# EAGLE design Organ_fix1 (EAGLE 7.7.0)
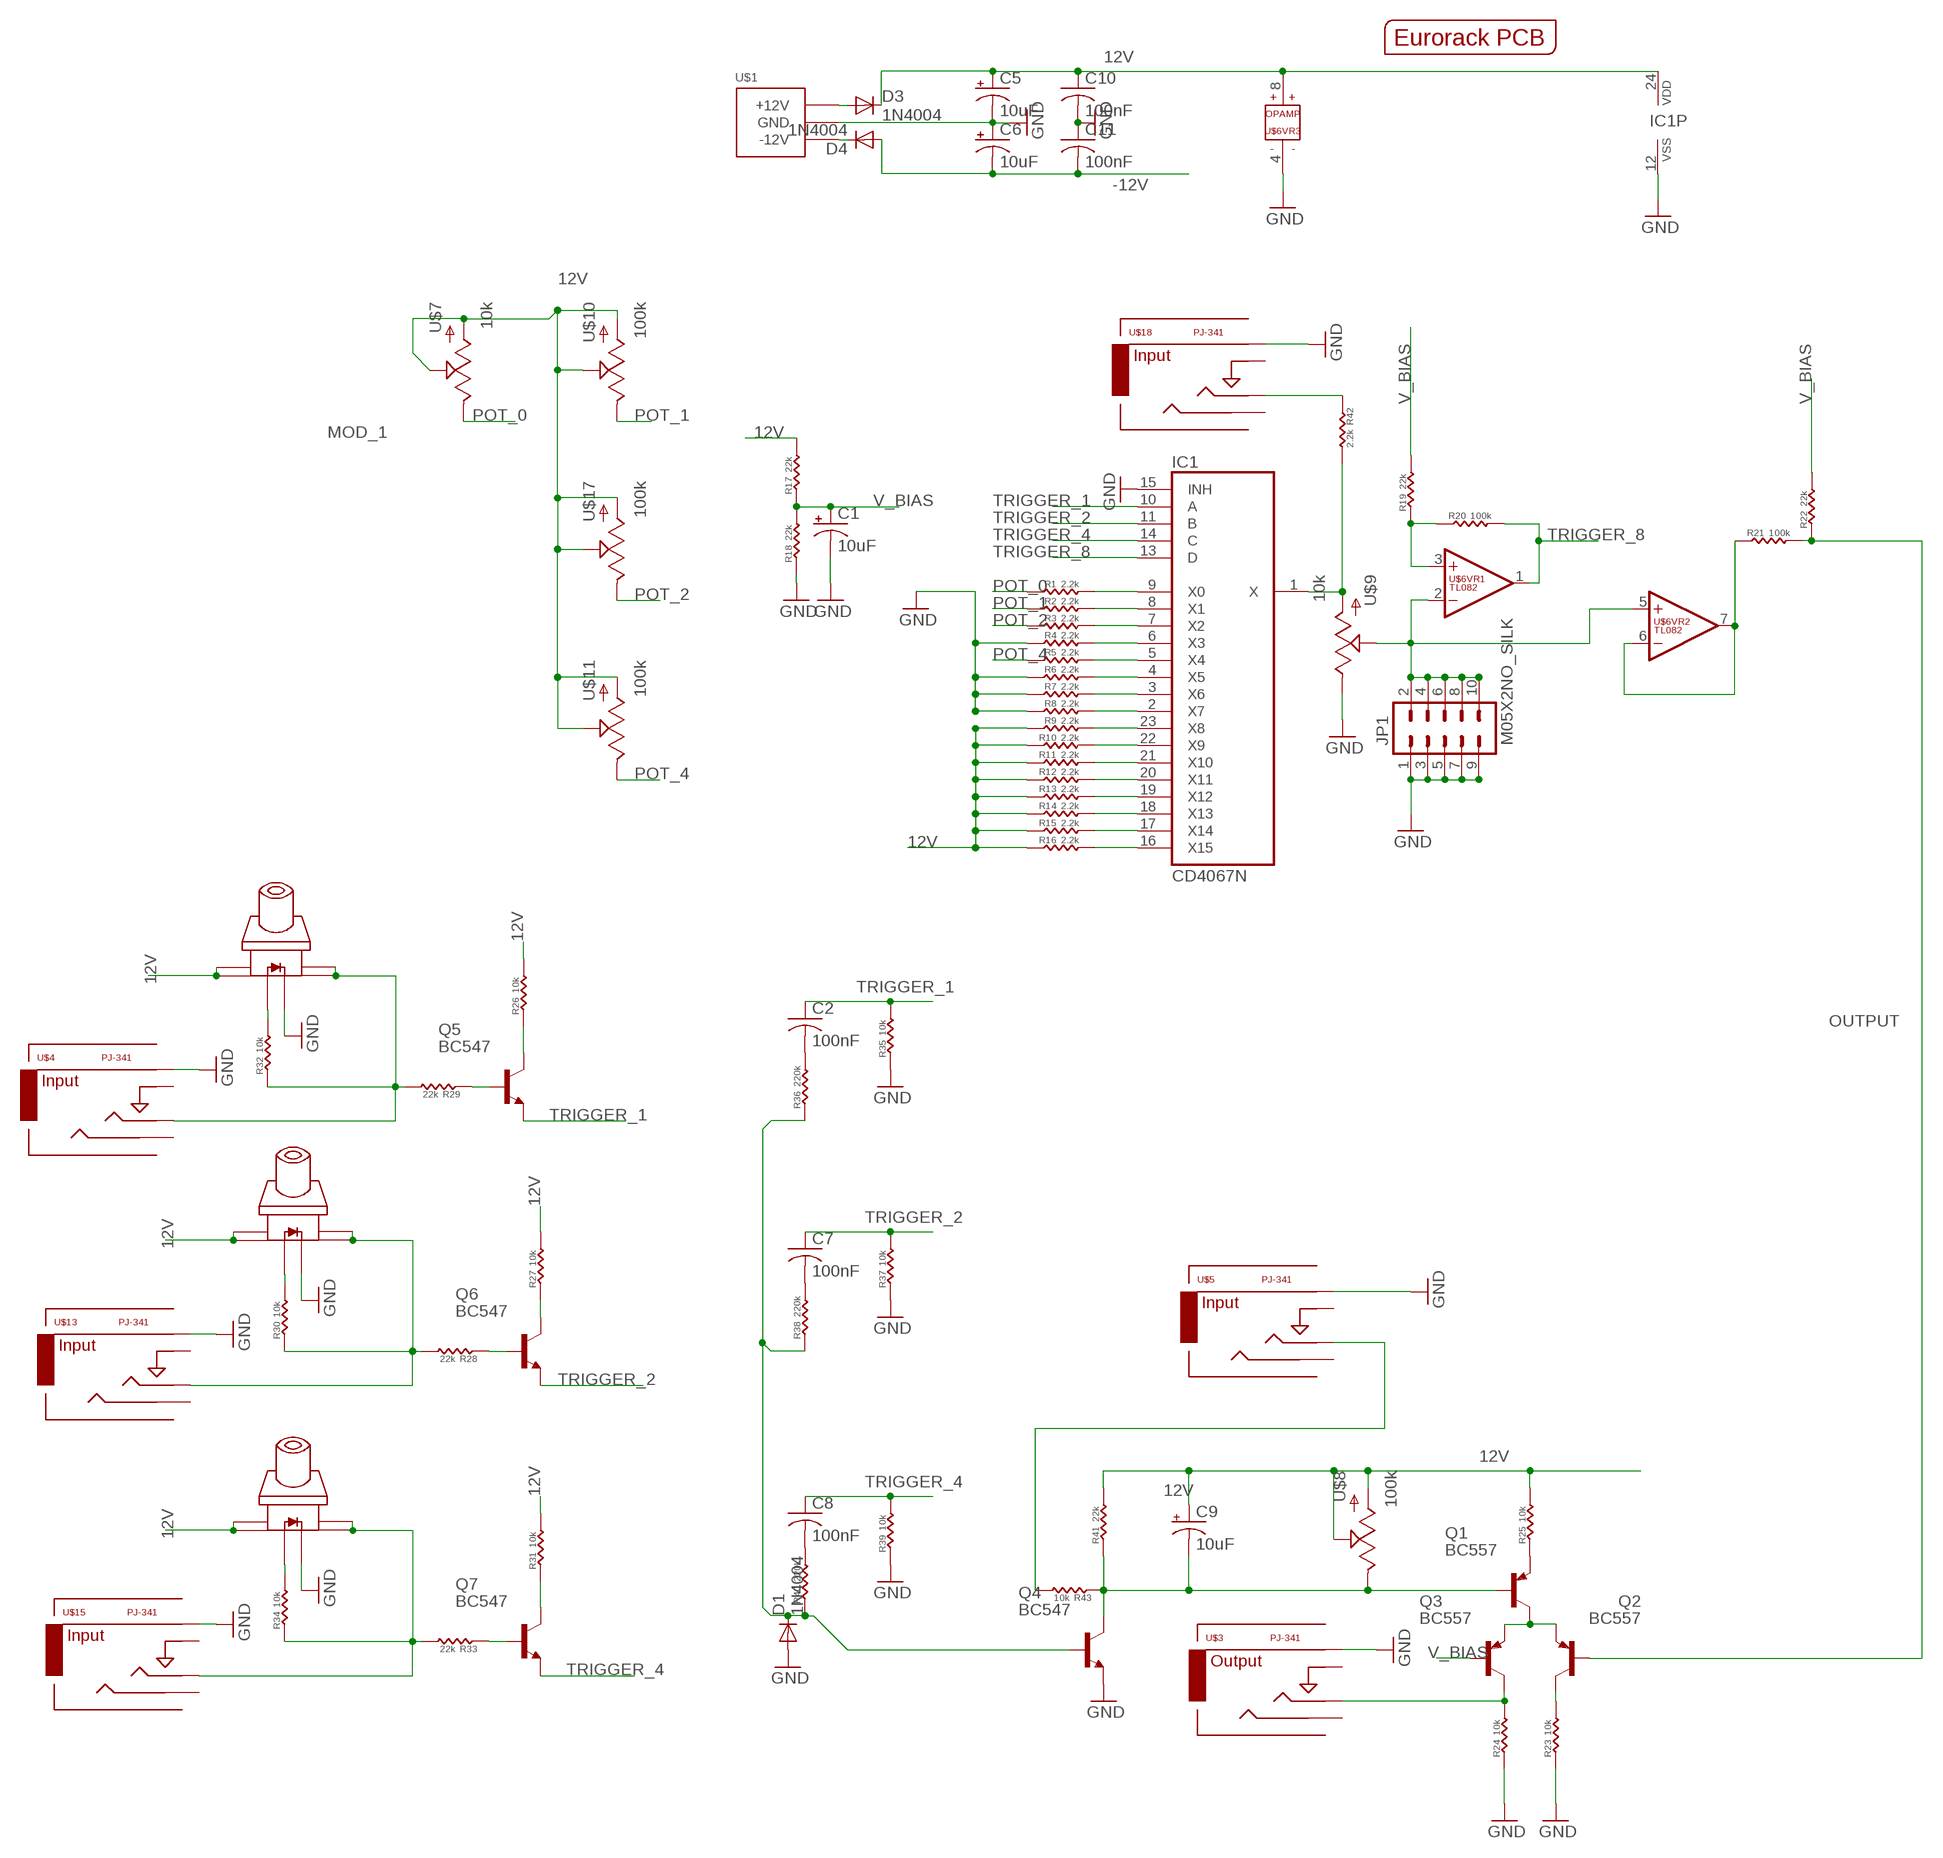
[diagram p0: schematic, sheet 1]

## Parts
C1  10uF  CPOL-USTT2D6  [TT2D6]
C2  100nF  C-US050-025X075  [C050-025X075]
C5  10uF  CPOL-USTT2D6  [TT2D6]
C6  10uF  CPOL-USTT2D6  [TT2D6]
C7  100nF  C-US050-025X075  [C050-025X075]
C8  100nF  C-US050-025X075  [C050-025X075]
C9  10uF  CPOL-USTT2D6  [TT2D6]
C10  100nF  C-US050-025X075  [C050-025X075]
C11  100nF  C-US050-025X075  [C050-025X075]
D1  1N4004  [DO41-10]
D3  1N4004  [DO41-10]
D4  1N4004  [DO41-10]
IC1  CD4067N  4067N  [DIL24-6]
JP1  M05X2NO_SILK  [2X5_NOSILK]
Q1  BC557  BC557TO92  [TO92]
Q2  BC557  BC557TO92  [TO92]
Q3  BC557  BC557TO92  [TO92]
Q4  BC547  [TO92]
Q5  BC547  [TO92]
Q6  BC547  [TO92]
Q7  BC547  [TO92]
R1  2.2k  R-US_0204/5  [0204/5]
R2  2.2k  R-US_0204/5  [0204/5]
R3  2.2k  R-US_0204/5  [0204/5]
R4  2.2k  R-US_0204/5  [0204/5]
R5  2.2k  R-US_0204/5  [0204/5]
R6  2.2k  R-US_0204/5  [0204/5]
R7  2.2k  R-US_0204/5  [0204/5]
R8  2.2k  R-US_0204/5  [0204/5]
R9  2.2k  R-US_0204/5  [0204/5]
R10  2.2k  R-US_0204/5  [0204/5]
R11  2.2k  R-US_0204/5  [0204/5]
R12  2.2k  R-US_0204/5  [0204/5]
R13  2.2k  R-US_0204/5  [0204/5]
R14  2.2k  R-US_0204/5  [0204/5]
R15  2.2k  R-US_0204/5  [0204/5]
R16  2.2k  R-US_0204/5  [0204/5]
R17  22k  R-US_0204/5  [0204/5]
R18  22k  R-US_0204/5  [0204/5]
R19  22k  R-US_0204/5  [0204/5]
R20  100k  R-US_0204/5  [0204/5]
R21  100k  R-US_0204/5  [0204/5]
R22  22k  R-US_0204/5  [0204/5]
R23  10k  R-US_0204/5  [0204/5]
R24  10k  R-US_0204/5  [0204/5]
R25  10k  R-US_0204/5  [0204/5]
R26  10k  R-US_0204/5  [0204/5]
R27  10k  R-US_0204/5  [0204/5]
R28  22k  R-US_0204/5  [0204/5]
R29  22k  R-US_0204/5  [0204/5]
R30  10k  R-US_0204/5  [0204/5]
R31  10k  R-US_0204/5  [0204/5]
R32  10k  R-US_0204/5  [0204/5]
R33  22k  R-US_0204/5  [0204/5]
R34  10k  R-US_0204/5  [0204/5]
R35  10k  R-US_0204/5  [0204/5]
R36  220k  R-US_0204/5  [0204/5]
R37  10k  R-US_0204/5  [0204/5]
R38  220k  R-US_0204/5  [0204/5]
R39  10k  R-US_0204/5  [0204/5]
R40  220k  R-US_0204/5  [0204/5]
R41  22k  R-US_0204/5  [0204/5]
R42  2.2k  R-US_0204/5  [0204/5]
R43  10k  R-US_0204/5  [0204/5]
U$1  POWER_SIMPLE10  [POWER_10]
U$2  EURORACK_PCB12HP  [EURORACK12HPPCB]
U$3  PJ-341  AUDIO-JACKOUTPUT  [3.5MM-JACK-SWITCH-13MM-OUTPUT]
U$4  PJ-341  AUDIO-JACKINPUT  [3.5MM-JACK-SWITCH-13MM-INPUT]
U$5  PJ-341  AUDIO-JACKINPUT  [3.5MM-JACK-SWITCH-13MM-INPUT]
U$6  TL082  TL072DIP  [DIL08]
U$7  10k  POTZEPHPOT_SMALLHOLE  [POT_SMALLERHOLE]
U$8  100k  POTZEPHPOT_SMALLHOLE  [POT_SMALLERHOLE]
U$9  10k  POTZEPHPOT_SMALLHOLE  [POT_SMALLERHOLE]
U$10  100k  POTZEPHPOT_SMALLHOLE  [POT_SMALLERHOLE]
U$11  100k  POTZEPHPOT_SMALLHOLE  [POT_SMALLERHOLE]
U$12  SWITCH_W_LED_PB6149L-X-102YELLOW  [PB6149L]
U$13  PJ-341  AUDIO-JACKINPUT  [3.5MM-JACK-SWITCH-13MM-INPUT]
U$14  SWITCH_W_LED_PB6149L-X-102YELLOW  [PB6149L]
U$15  PJ-341  AUDIO-JACKINPUT  [3.5MM-JACK-SWITCH-13MM-INPUT]
U$16  SWITCH_W_LED_PB6149L-X-102YELLOW  [PB6149L]
U$17  100k  POTZEPHPOT_SMALLHOLE  [POT_SMALLERHOLE]
U$18  PJ-341  AUDIO-JACKINPUT  [3.5MM-JACK-SWITCH-13MM-INPUT]

## Nets
12V: C5.+ C9.+ C10.1 D3.C IC1.24(VDD) R9.1 R10.1 R11.1 R12.1 R13.1 R14.1 R15.1 R16.1 R17.2 R25.2 R26.2 R27.2 R31.2 R41.2 U$6.8(VR3:V+) U$7.P$2(S) U$7.P$3(A) U$8.P$2(S) U$8.P$3(A) U$10.P$2(S) U$10.P$3(A) U$11.P$2(S) U$11.P$3(A) U$12.1 U$12.2 U$14.1 U$14.2 U$16.1 U$16.2 U$17.P$2(S) U$17.P$3(A)
-12V: C6.- C11.2 D4.A
GND: C1.- C5.- C6.+ C10.2 C11.1 D1.A IC1.12(VSS) IC1.15(INH) JP1.1 JP1.3 JP1.5 JP1.7 JP1.9 Q4.1(E) R4.1 R6.1 R7.1 R8.1 R18.1 R23.1 R24.1 R35.1 R37.1 R39.1 U$1.3(GND) U$1.4(GND) U$1.5(GND) U$1.6(GND) U$1.7(GND) U$1.8(GND) U$3.RING@3(RING) U$4.RING@3(RING) U$5.RING@3(RING) U$6.4(VR3:V-) U$9.P$1(E) U$12.LEDNEG(NEG) U$13.RING@3(RING) U$14.LEDNEG(NEG) U$15.RING@3(RING) U$16.LEDNEG(NEG) U$18.RING@3(RING)
MOD_1: IC1.1(X) R42.2 U$9.P$3(A)
N$1: IC1.9(X0) R1.2
N$2: IC1.8(X1) R2.2
N$3: IC1.7(X2) R3.2
N$4: IC1.6(X3) R4.2
N$5: IC1.5(X4) R5.2
N$6: IC1.4(X5) R6.2
N$7: IC1.3(X6) R7.2
N$8: IC1.2(X7) R8.2
N$9: IC1.23(X8) R9.2
N$10: IC1.22(X9) R10.2
N$11: IC1.21(X10) R11.2
N$12: IC1.20(X11) R12.2
N$13: IC1.19(X12) R13.2
N$14: IC1.18(X13) R14.2
N$15: IC1.17(X14) R15.2
N$16: IC1.16(X15) R16.2
N$17: D3.A U$1.9(+12V) U$1.10(+12V)
N$18: D4.C U$1.1(-12V) U$1.2(-12V)
N$19: R21.1 U$6.6(VR2:-IN) U$6.7(VR2:OUT)
N$20: JP1.2 JP1.4 JP1.6 JP1.8 JP1.10 U$6.2(VR1:-IN) U$6.5(VR2:+IN) U$9.P$2(S)
N$21: Q1.3(C) Q2.1(E) Q3.1(E)
N$22: R19.1 R20.1 U$6.3(VR1:+IN)
N$23: R42.1 U$18.TIP@3(TIP)
N$24: Q2.3(C) R23.2
N$25: Q3.3(C) R24.2 U$3.TIP@3(TIP)
N$26: R43.2 U$5.TIP@3(TIP)
N$27: Q1.1(E) R25.1
N$28: Q6.3(C) R27.1
N$29: Q5.3(C) R26.1
N$30: Q7.3(C) R31.1
N$44: C2.2 R36.2
N$45: C9.- Q1.2(B) Q4.3(C) R41.1 R43.1 U$8.P$1(E)
N$46: Q6.2(B) R28.1
N$47: Q5.2(B) R29.1
N$49: R30.2 U$14.LEDPOS(POS)
N$51: R32.2 U$12.LEDPOS(POS)
N$52: D1.C Q4.2(B) R36.1 R38.1 R40.1
N$53: Q7.2(B) R33.1
N$55: R34.2 U$16.LEDPOS(POS)
N$56: C7.2 R38.2
N$59: C8.2 R40.2
OUTPUT: Q2.2(B) R21.2 R22.1
POT_0: R1.1 U$7.P$1(E)
POT_1: R2.1 U$10.P$1(E)
POT_2: R3.1 U$17.P$1(E)
POT_4: R5.1 U$11.P$1(E)
TRIGGER_1: C2.1 IC1.10(A) Q5.1(E) R35.2
TRIGGER_1_IN: R29.2 R32.1 U$4.TIP@3(TIP) U$12.3 U$12.4
TRIGGER_2: C7.1 IC1.11(B) Q6.1(E) R37.2
TRIGGER_2_IN: R28.2 R30.1 U$13.TIP@3(TIP) U$14.3 U$14.4
TRIGGER_4: C8.1 IC1.14(C) Q7.1(E) R39.2
TRIGGER_4_IN: R33.2 R34.1 U$15.TIP@3(TIP) U$16.3 U$16.4
TRIGGER_8: IC1.13(D) R20.2 U$6.1(VR1:OUT)
V_BIAS: C1.+ Q3.2(B) R17.1 R18.2 R19.2 R22.2
Unconnected: U$3.SECOND@3(SECOND) U$3.SWITCH@3(SWITCH) U$4.SECOND@3(SECOND) U$4.SWITCH@3(SWITCH) U$5.SECOND@3(SECOND) U$5.SWITCH@3(SWITCH) U$13.SECOND@3(SECOND) U$13.SWITCH@3(SWITCH) U$15.SECOND@3(SECOND) U$15.SWITCH@3(SWITCH) U$18.SECOND@3(SECOND) U$18.SWITCH@3(SWITCH)

## Library data of the parts
C1 C5 C6 C9 = LompeOnderdelen:CPOL-US: POLARIZED CAPACITOR, American symbol
C2 C7 C8 C10 C11 = LompeOnderdelen:C-US: CAPACITOR, American symbol
D1 D3 D4 = adafruit:1N4004: DIODE General purpose 1N400x type rectifier (With bigger pads) http://www.ladyada.net/library/pcb/eaglelibrary.html
IC1 = LompeOnderdelen:4067: 16-channel ANALOG MULTIPLEXER
JP1 = SparkFun-Connectors:M05X2: Header 5x2 Standard 10-pin dual row 0.1" header. Commonly used with AVR-ISP. Use with Spark Fun Electronics SKU: PRT-00778
Q1-Q3 = LompeOnderdelen:BC557*: PNP Transistror
Q4-Q7 = LompeOnderdelen:BC547*: NPN Transistor
R1-R43 = LompeOnderdelen:R-US_: RESISTOR, American symbol
U$1 = EurorackModularParts:POWER_SIMPLE
U$2 = EurorackModularParts:EURORACK_PCB
U$3 = EurorackModularParts:AUDIO-JACK: Switching Mono 3.5mm Audio Jack from Erthenvar.; DESC: Output; MPN: PJ-341
U$4 U$5 U$13 U$15 U$18 = EurorackModularParts:AUDIO-JACK: Switching Mono 3.5mm Audio Jack from Erthenvar.; DESC: Input; MPN: PJ-341
U$6 = LompeOnderdelen:TL072
U$7-U$11 U$17 = EurorackModularParts:POT
U$12 U$14 U$16 = zephod-components:SWITCH_W_LED_PB6149L-X-102

## Net classes
0 default: width 0.406 mm, clearance 0.178 mm
3 groundplane: width 0.203 mm, clearance 0.203 mm

## Board
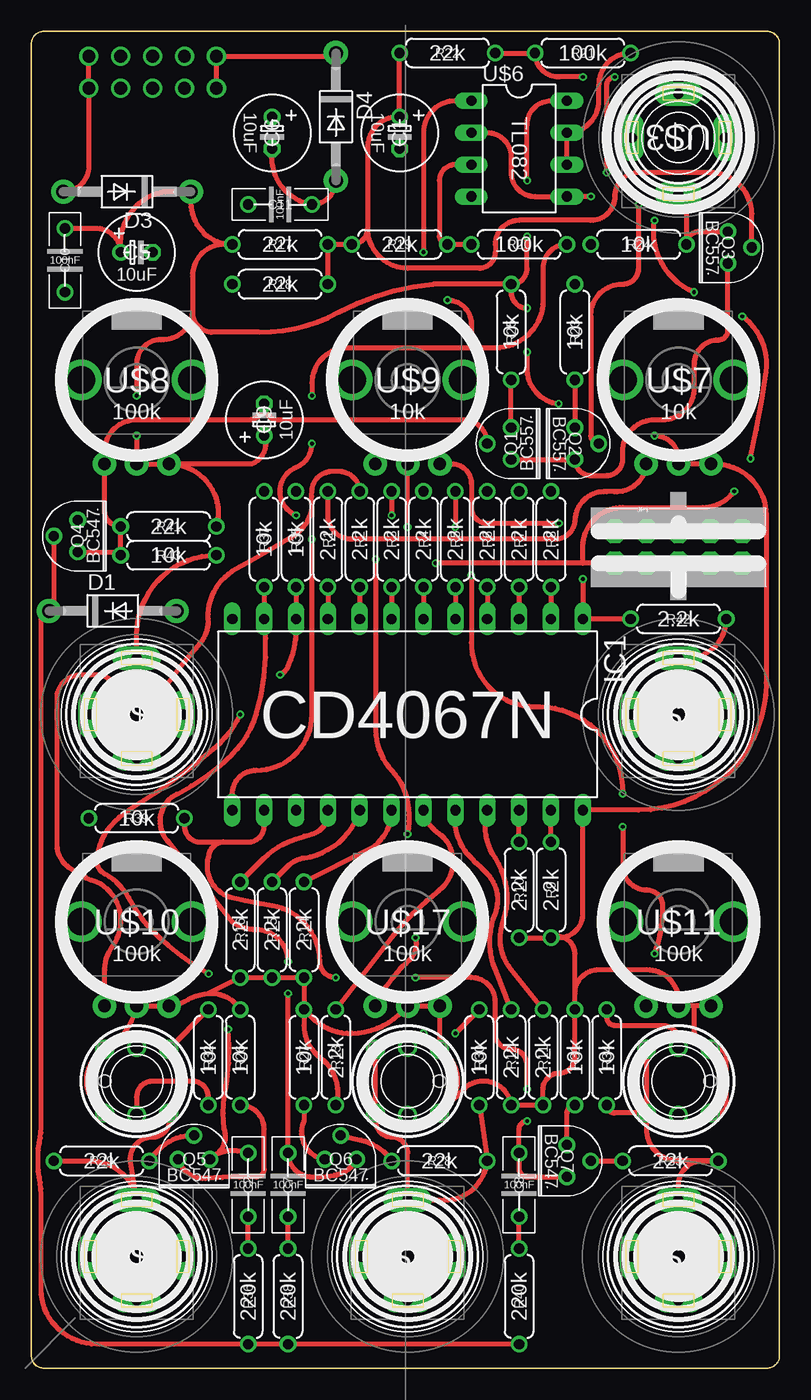
[diagram p1: board, top side]
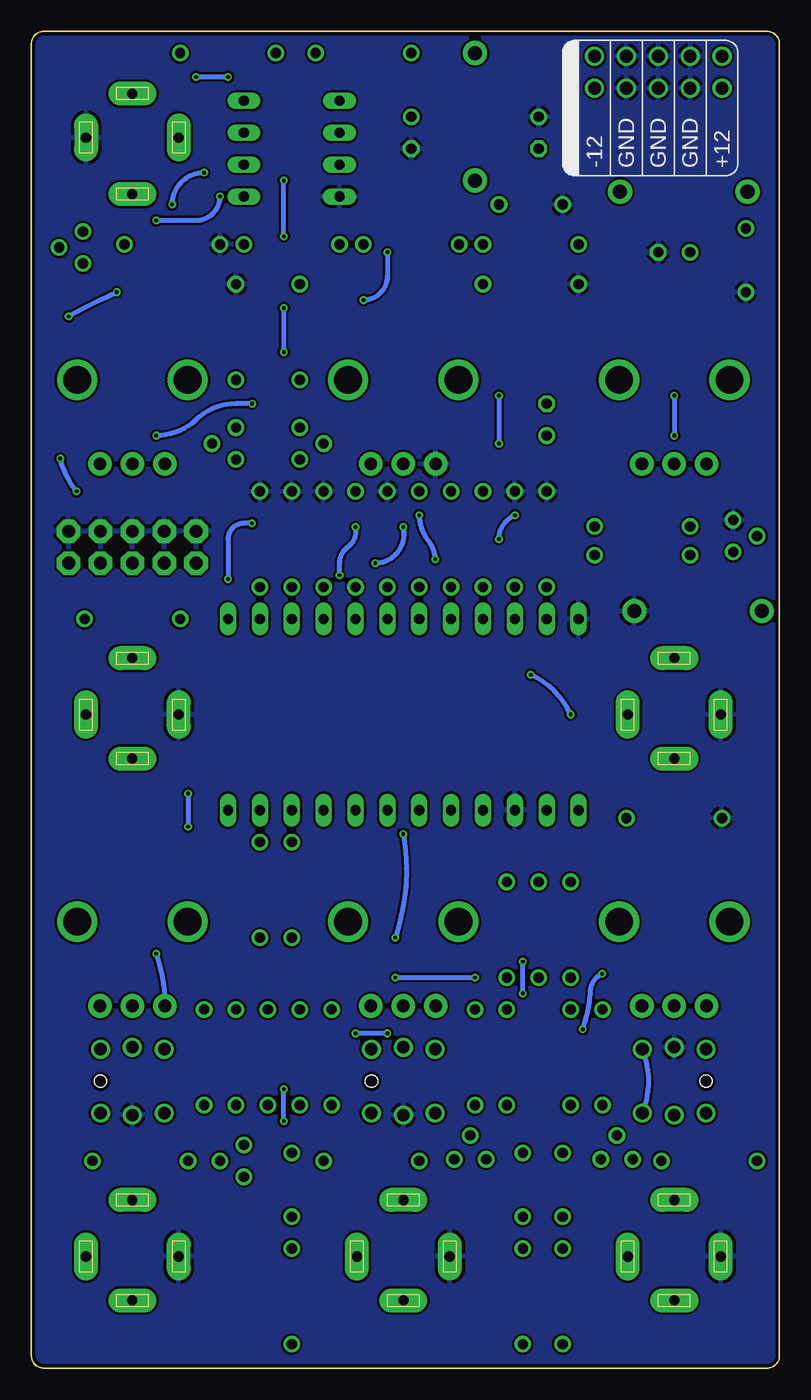
[diagram p2: board, bottom side, seen from below]

Size 59.62 x 106.5 mm. Coordinates in mm from the lower left corner, seen from the top.
Copper layers (1*16): Top 0.035mm / dielectric 1.5mm / Bottom 0.035mm
Design rules "ITEADstudio_DRC": minimum track width 6mil, minimum drill 12mil, track to track 6mil, track to pad 6mil, pad to pad 6mil, via to via 6mil, smd to smd 0mil, copper to edge 10mil, drill to drill 10mil, minimum pad ring 10mil, minimum via ring 6mil, stop-mask expansion 2mil, vias tented up to drill 100mil, thermal gap 10mil

### Footprints (pad centres in the part's own frame; a part is rotated, then mirrored left to right if it is on the bottom)
TT2D6 = drill 0.813: + -1.27,0 | drill 0.813 octagon: - 1.27,0
C050-025X075 = drill 0.813: 1 -2.54,0; 2 2.54,0
DO41-10 = drill 1.118 pad 1.93: A 5.08,0; C -5.08,0
DIL24-6 = drill 0.813 long: 1 -13.97,-7.62; 2 -11.43,-7.62; 3 -8.89,-7.62; 4 -6.35,-7.62; 5 -3.81,-7.62; 6 -1.27,-7.62; 7 1.27,-7.62; 8 3.81,-7.62; 9 6.35,-7.62; 10 8.89,-7.62; 11 11.43,-7.62; 12 13.97,-7.62; 13 13.97,7.62; 14 11.43,7.62; 15 8.89,7.62; 16 6.35,7.62; 17 3.81,7.62; 18 1.27,7.62; 19 -1.27,7.62; 20 -3.81,7.62; 21 -6.35,7.62; 22 -8.89,7.62; 23 -11.43,7.62; 24 -13.97,7.62
2X5_NOSILK = drill 1.016 pad 1.88 octagon: 1 -1.27,5.08; 2 1.27,5.08; 3 -1.27,2.54; 4 1.27,2.54; 5 -1.27,0; 6 1.27,0; 7 -1.27,-2.54; 8 1.27,-2.54; 9 -1.27,-5.08; 10 1.27,-5.08
TO92 = drill 0.813: 1 1.27,0; 2 0,1.905; 3 -1.27,0
0204/5 = drill 0.813: 1 -3.81,0; 2 3.81,0
POWER_10 = drill 1.016: 1 -5.08,-1.27; 2 -5.08,1.27; 3 -2.54,-1.27; 4 -2.54,1.27; 5 0,-1.27; 6 0,1.27; 7 2.54,-1.27; 8 2.54,1.27; 9 5.08,-1.27; 10 5.08,1.27
3.5MM-JACK-SWITCH-13MM-OUTPUT = drill 0.8 pad 1.93 long: RING@3 -3.7,0; SECOND@3 0,-3.5; SWITCH@3 3.7,0; TIP@3 0,4.5
3.5MM-JACK-SWITCH-13MM-INPUT = drill 0.8 pad 1.93 long: RING@3 -3.7,0; SECOND@3 0,-3.5; SWITCH@3 3.7,0; TIP@3 0,4.5
DIL08 = drill 0.813 long: 1 -3.81,-3.81; 2 -1.27,-3.81; 3 1.27,-3.81; 4 3.81,-3.81; 5 3.81,3.81; 6 1.27,3.81; 7 -1.27,3.81; 8 -3.81,3.81
POT_SMALLERHOLE = drill 1 pad 1.88: P$1 -2.58,-6.7; P$2 0,-6.7; P$3 2.58,-6.7 | drill 2.2 pad 3.175: P$4 4.4,0; P$5 -4.4,0
PB6149L = drill 1: 1 2.54,2.54; 2 2.54,-2.54; 3 -2.54,2.54; 4 -2.54,-2.54; LEDNEG 0,-2.7; LEDPOS 0,2.7 | hole 1: 2.54,0

### Placement (x,y rotation side)
C1  29.34,98.42 270 top
C2  17.28,14.61 270 top
C5  8.39,88.9 0 top
C6  19.18,98.42 270 top
C7  20.45,14.61 270 top
C8  38.87,14.61 270 top
C9  18.55,75.56 90 top
C10  2.67,88.27 270 top
C11  19.82,92.71 0 top
D1  6.49,60.33 0 top
D3  7.63,93.73 180 top
D4  24.27,99.69 270 top
IC1  29.98,52.07 180 top
JP1  51.57,65.41 270 top
Q1  38.23,73.66 90 top
Q2  43.31,73.66 270 top
Q3  55.51,89.28 270 top
Q4  3.69,66.29 90 top
Q5  12.96,16.64 0 top
Q6  24.65,16.64 0 top
Q7  42.68,16.51 270 top
R1  23.63,66.04 270 top
R2  26.17,66.04 270 top
R3  28.71,66.04 270 top
R4  31.25,66.04 270 top
R5  33.79,66.04 270 top
R6  36.33,66.04 270 top
R7  38.87,66.04 270 top
R8  41.41,66.04 270 top
R9  41.41,38.1 90 top
R10  38.87,38.1 90 top
R11  40.77,24.77 90 top
R12  38.23,24.77 90 top
R13  24.27,24.77 90 top
R14  21.73,34.92 90 top
R15  19.18,34.92 90 top
R16  16.64,34.92 90 top
R17  19.82,89.53 180 top
R18  19.82,86.36 0 top
R19  29.34,89.53 180 top
R20  38.87,89.53 0 top
R21  43.95,104.78 180 top
R22  33.16,104.78 180 top
R23  43.31,82.55 270 top
R24  48.4,89.53 0 top
R25  38.23,82.55 90 top
R26  16.64,24.77 90 top
R27  21.73,24.77 90 top
R28  32.52,16.51 0 top
R29  5.6,16.51 180 top
R30  35.7,24.77 90 top
R31  43.31,24.77 90 top
R32  14.11,24.77 270 top
R33  50.94,16.51 0 top
R34  45.85,24.77 90 top
R35  21.09,66.04 270 top
R36  17.28,5.71 90 top
R37  18.55,66.04 270 top
R38  20.45,5.71 90 top
R39  8.39,43.81 0 top
R40  38.87,5.71 90 top
R41  10.93,67.06 0 top
R42  51.57,59.69 180 top
R43  10.93,64.77 0 top
U$1  9.66,103.25 0 bottom
U$2  -0.5,0 0 top
U$3  51.57,98.04 180 top
U$4  8.39,8.89 0 top
U$5  8.39,52.07 0 top
U$6  38.87,97.16 270 top
U$7  51.57,78.74 0 top
U$8  8.39,78.74 0 top
U$9  29.98,78.74 0 top
U$10  8.39,35.56 0 top
U$11  51.57,35.56 0 top
U$12  8.39,22.86 180 top
U$13  29.98,8.89 0 top
U$14  29.98,22.86 0 top
U$15  51.57,8.89 0 top
U$16  51.57,22.86 0 top
U$17  29.98,35.56 0 top
U$18  51.57,52.07 0 top

### Tracks (layer width: path | path; a pad name or v marks a point on that pad's centre or on a via)
12V  (via drill 0.3)
  Top 0.406: U$8.P$3 U$8.P$2 v8.39,74.3 | C10.1 5.09,90.81 arc-90 C5.+ arc-90 10.68,93.73 D3.C 12.71,92.84 arc90 R17.2 15.38,89.53 arc90 12.84,87 12.84,84.15 | 12.84,84.15 arc-90 10.32,81.94 arc90 8.39,80.01 v8.39,77.47 | U$8.P$3 arc-106 R41.2 | C9.+ arc-90 17.57,72.04 U$8.P$3 | 12.84,84.15 arc90 14.44,82.55 18.14,82.55 arc30 24.49,84.12 arc-23 32.01,86.36 R25.2 | U$12.1 5.21,20.95 arc-106 U$12.2 arc50 U$10.P$2 U$10.P$3 arc32 12.2,29.21 arc-27 14.11,29.84 | U$16.2 54.74,20.32 arc90 55.38,20.95 55.38,24.77 arc90 54.74,25.4 U$16.1 arc-90 52.84,26.67 52.84,28.86 | 14.11,29.84 arc-63 R26.2 | 14.11,29.84 R16.1 R15.1 R14.1 R27.2 | R27.2 21.73,27.3 arc53 23,24.77 arc-69 R13.1 | U$14.2 33.16,20.95 | 33.16,20.95 arc106 U$14.1 32.52,28.86 U$17.P$3 U$17.P$2 arc-50 25.54,26.67 arc-46 22.36,27.94 R27.2 | 33.16,20.95 34.42,22.23 arc-127 R12.1 R11.1 40.77,22.23 arc-90 42.05,23.5 arc90 43.31,24.77 R31.2 43.31,29.84 | 43.31,29.84 43.31,33.02 arc111 R9.1 | R10.1 R9.1 | R25.2 arc90 39.51,87.63 v39.51,90.17 | v39.51,94.61 39.51,99.06 arc-90 41.41,100.97 U$6.8 | U$11.P$3 52.84,28.86 | 52.84,28.86 U$11.P$2 arc97 49.03,31.75 45.22,31.75 arc90 43.31,29.84 | R9.1 42.05,34.29 arc90 43.95,36.2 IC1.24 48.4,44.45 arc90 58.55,54.61 58.55,67.94 arc90 54.46,72.04 U$7.P$3 U$7.P$2 arc100 v49.66,74.3 | R25.2 38.23,85.72 arc90 v39.51,84.45 | v39.51,80.95 39.51,79.96 arc90 v42.02,76.83
  Bottom 0.406: v8.39,77.47 v8.39,74.3 | v39.51,90.17 v39.51,94.61 | v39.51,84.45 v39.51,80.95 | v42.02,76.83 43.31,76.83 arc-44 46.49,75.56 arc44 v49.66,74.3
-12V
  Top 0.406: C6.- arc90 C11.2 arc90 D4.A
GND
  pour Bottom: 0.14,106.68 59.83,106.68 59.83,0 0.14,0
MOD_1  (via drill 0.3)
  Top 0.406: R42.2 IC1.1 v43.95,62.87 | U$9.P$3 33.51,72.04 arc-90 35.06,70.48 35.06,68.58 arc90 36.33,67.31 v42.05,67.31
  Bottom 0.406: v42.05,67.31 42.68,67.31 arc-90 43.95,66.04 v43.95,62.87
N$1
  Top 0.406: R1.2 IC1.9
N$2
  Top 0.406: R2.2 IC1.8
N$3
  Top 0.406: R3.2 IC1.7
N$4
  Top 0.406: R4.2 IC1.6
N$5
  Top 0.406: R5.2 IC1.5
N$6
  Top 0.406: R6.2 IC1.4
N$7
  Top 0.406: R7.2 IC1.3
N$8
  Top 0.406: R8.2 IC1.2
N$9
  Top 0.406: R9.2 IC1.23
N$10
  Top 0.406: R10.2 IC1.22
N$11
  Top 0.406: R11.2 38.23,31.75 arc-58 37.6,35.56 arc54 36.97,40.64 arc-49 IC1.21
N$12
  Top 0.406: R12.2 36.97,31.75 arc-44 36.97,36.2 arc66 36.33,39.37 arc1 35.06,40.64 arc-54 IC1.20
N$13
  Top 0.406: R13.2 28.71,34.29 arc-14 32.52,38.1 arc85 33.16,41.91 arc24 32.52,42.55 arc-46 IC1.19
N$14
  Top 0.406: R14.2 26.8,41.27 arc65 IC1.18
N$15
  Top 0.406: R15.2 20.45,40.01 arc-37 21.73,40.64 arc65 IC1.17
N$16
  Top 0.406: R16.2 18.55,40.64 arc-23 20.45,41.91 arc-8 22.36,42.55 arc84 IC1.16
N$17
  Top 0.406: D3.A arc90 4.58,95.76 U$1.9 U$1.10
N$18
  Top 0.406: U$1.1 U$1.2 24.01,104.52 arc90 D4.C
N$19
  Top 0.406: R21.1 arc90 45.22,102.23 45.22,100.97 arc-90 U$6.7 U$6.6
N$20  (via drill 0.3)
  Top 0.406: U$6.2 36.33,98.42 arc-90 38.23,96.52 38.23,95.25 arc90 40.14,93.34 U$6.5 v44.59,93.34 | 29.98,72.39 U$9.P$2 v29.98,67 | JP1.2 JP1.4 JP1.6 JP1.8 JP1.10 43.95,64.14 | 43.95,64.14 v32.22,64.14 | 43.95,64.14 43.95,65.41 arc-53 45.22,67.94 arc-37 47.12,68.58 53.48,68.58 arc53 v56.02,69.85 | v57.31,72.47 arc5 58.55,79.38 arc63 v56.65,83.8 | v52.81,85.72 arc-77 v49.66,91.44
  Bottom 0.406: v32.22,64.14 arc-103 v29.98,67 | v56.02,69.85 arc27 v57.31,72.47 | v56.65,83.8 arc5 v52.81,85.72 | v49.66,91.44 46.49,91.44 arc-90 v44.59,93.34
N$21
  Top 0.406: Q3.1 55.51,82.68 arc-90 54.74,81.92 arc90 52.84,80.01 52.84,78.11 arc-90 50.3,75.56 49.66,75.56 arc90 47.12,73.03 47.12,72.39 arc-90 45.85,71.12 44.59,71.12 arc-90 Q2.1 Q1.3
N$22
  Top 0.406: R20.1 R19.1 arc-90 32.52,90.17 32.52,94.61 arc-90 33.79,95.89 U$6.3
N$23
  Top 0.406: U$18.TIP@3 52.26,56.57 arc90 R42.1
N$24
  Top 0.406: R23.2 Q2.3
N$25
  Top 0.406: U$3.TIP@3 arc-90 52.2,92.91 R24.2 arc-90 53.22,90.55 Q3.3
N$26
  Top 0.406: U$5.TIP@3 8.39,58.42 arc-90 R43.2
N$27
  Top 0.406: Q1.1 R25.1
N$28
  Top 0.406: R27.1 21.73,19.68 arc106 Q6.3
N$29
  Top 0.406: R26.1 arc-90 18.55,19.05 18.55,15.88 arc-90 17.91,15.24 arc4 13.85,15.11 arc-78 Q5.3
N$30
  Top 0.406: Q7.3 42.68,20.32 arc-90 R31.1
N$44
  Top 0.406: R36.2 C2.2
N$45
  Top 0.406: Q4.3 6.87,65.02 arc-90 R43.1 R41.1 arc-90 5.81,68.37 U$8.P$1 5.81,72.98 arc-90 8.39,75.56 17.41,75.56 arc90 C9.- arc90 19.57,75.56 34.42,75.56 arc-90 Q1.2
N$46
  Top 0.406: Q6.2 26.3,18.16 arc-43 R28.1
N$47
  Top 0.406: R29.1 9.91,17.14 arc-53 Q5.2
N$49  (via drill 0.3)
  Top 0.406: U$14.LEDPOS v31.25,26.67 | v33.79,26.67 R30.2
  Bottom 0.406: v31.25,26.67 v33.79,26.67
N$51
  Top 0.406: R32.2 14.11,21.59 arc90 12.84,22.86 9.66,22.86 arc90 8.39,21.59 U$12.LEDPOS
N$52
  Top 0.406: R40.1 R38.1 R36.1 5.21,1.91 arc-90 0.77,6.35 0.77,13.84 arc10 0.64,15.24 arc-21 0.64,17.91 arc9 0.77,19.18 0.77,59.69 arc-90 D1.C arc90 1.79,60.71 Q4.2
N$53
  Top 0.406: Q7.2 R33.1
N$55
  Top 0.406: R34.2 45.85,27.94 arc90 46.49,27.3 50.3,27.3 arc-108 U$16.LEDPOS
N$56
  Top 0.406: R38.2 C7.2
N$59
  Top 0.406: R40.2 C8.2
OUTPUT  (via drill 0.3)
  Top 0.406: R22.1 R21.2 arc90 42.05,102.87 v43.95,102.87 | v48.4,92.71 48.4,87.63 arc-90 47.12,86.36 47.07,86.36 arc90 44.59,83.87 44.59,74.3 arc90 Q2.2 | v45.85,95.25 45.85,102.23 arc-90 v46.49,102.87
  Bottom 0.406: v48.4,92.71 arc90 v45.85,95.25 | v46.49,102.87 v43.95,102.87
POT_0
  Top 0.406: U$7.P$1 arc-90 46.47,69.83 45.83,69.83 arc90 43.31,67.61 arc-90 41.74,66.04 25.54,66.04 arc-90 23.63,67.94 R1.1
POT_1
  Top 0.406: U$10.P$1 5.85,31.75 arc-35 6.49,33.66 arc100 5.21,38.73 arc-22 3.18,39.75 arc-56 2.04,41.66 2.04,53.34 arc-90 3.95,55.24 5.21,55.24 arc-53 6.49,54.61 arc53 7.76,53.98 9.66,53.98 arc53 10.93,54.61 arc-4 13.47,57.78 arc44 14.11,59.69 arc-60 16.01,63.5 arc1 20.51,66.09 arc59 22.36,68.58 arc-6 22.36,69.9 arc-84 23.91,71.45 arc-6 24.57,71.45 arc-84 R2.1
POT_2  (via drill 0.3)
  Top 0.406: R3.1 v28.71,67.94 | v27.44,64.44 27.44,50.8 arc44 28.71,47.62 arc-34 29.98,45.09 arc-19 v29.98,42.55 | v30.61,34.29 arc-66 29.98,32.38 arc4 29.34,31.75 arc18 U$17.P$1
  Bottom 0.406: v28.71,67.94 arc-37 28.07,66.04 arc37 v27.44,64.44 | v29.98,42.55 arc29 v30.61,34.29
POT_4  (via drill 0.3)
  Top 0.406: R5.1 v33.79,67 | v35.06,63.17 35.06,57.78 arc90 40.14,52.7 40.5,52.7 arc-90 v47.12,45.77 | v47.12,43.13 47.12,40.01 arc90 49.03,38.1 arc-90 50.3,36.83 arc-19 v49.66,33.02
  Bottom 0.406: v47.12,45.77 v47.12,43.13 | v49.66,33.02 arc19 U$11.P$1 | v35.06,63.17 35.06,64.14 arc53 34.42,65.41 arc-69 v33.79,67
TRIGGER_1  (via drill 0.3)
  Top 0.406: R35.2 IC1.10 arc-30 20.45,55.88 arc-41 v19.82,55.24 | v15.68,27 arc-16 15.38,21.59 arc16 15.38,19.05 arc-72 14.74,17.02 | v14.13,31.42 arc-10 10.93,33.66 arc-23 7.76,37.47 arc33 5.85,39.37 arc-70 5.21,40.64 arc-50 7.76,44.45 arc10 14.74,49.53 arc25 v16.64,52.07 | Q5.1 14.74,17.02 | C2.1 16.64,17.27 arc38 14.74,17.02
  Bottom 0.406: v15.68,27 arc-16 15.07,29.84 arc69 v14.13,31.42 | v16.64,52.07 arc-41 v19.82,55.24
TRIGGER_1_IN
  Top 0.406: U$12.3 arc-113 9.66,18.41 arc98 7.88,16.38 arc4 U$4.TIP@3 arc81 4.71,16.51 R29.2 | U$12.4 R32.1
  Bottom 0.406: U$12.3 arc-45 U$12.4
TRIGGER_2  (via drill 0.3)
  Top 0.406: R37.2 IC1.11 arc-23 17.91,52.07 arc-29 16.01,48.9 arc-18 11.56,45.72 arc108 10.93,41.91 16.01,35.56 arc37 17.91,34.92 arc-90 v20.45,32.38 | v20.45,29.84 C7.1 arc90 22.36,15.24 arc8 24.14,15.37 arc55 Q6.1
  Bottom 0.406: v20.45,29.84 v20.45,32.38
TRIGGER_2_IN
  Top 0.406: R30.1 R28.2 arc-90 32.58,13.39 U$13.TIP@3 29.98,17.14 arc90 28.71,18.41 arc-90 27.44,19.68 U$14.4 U$14.3
TRIGGER_4  (via drill 0.3)
  Top 0.406: Q7.1 39.51,15.24 arc-90 38.87,15.88 C8.1 38.87,19.05 arc-90 v39.51,19.68 | R39.2 12.2,43.18 arc90 13.47,41.91 15.38,41.91 | 15.38,41.91 17.28,41.91 arc90 18.55,43.18 IC1.14 | v39.51,22.23 39.51,24.13 arc90 38.23,25.4 arc-90 36.97,26.67 36.97,29.21 arc90 35.06,31.11 v30.61,31.11 | v24.27,31.11 arc-90 23,32.38 arc81 19.18,36.83 arc-5 16.01,37.47 arc-90 14.11,40.64 arc-90 15.38,41.91
  Bottom 0.406: v39.51,19.68 v39.51,22.23 | v30.61,31.11 v24.27,31.11
TRIGGER_4_IN
  Top 0.406: U$15.TIP@3 51.57,14.61 arc-90 53.48,16.51 R33.2 51.57,16.51 arc-90 49.03,19.05 U$16.4 | U$16.4 U$16.3 | U$16.4 46.49,20.32 arc-90 R34.1
TRIGGER_8  (via drill 0.3)
  Top 0.406: R20.2 arc90 40.77,87.63 40.77,85.09 arc-90 36.97,81.28 35.06,81.28 | 35.06,81.28 25.15,81.28 arc90 22.36,78.49 v22.36,77.47 | U$6.1 33.79,100.97 arc90 31.25,98.42 v31.25,88.9 | v33.16,85.09 arc-90 35.06,83.19 35.06,81.28 | IC1.13 16.01,45.72 arc-90 17.91,47.62 arc90 22.36,52.07 v22.36,66.04 | v21.09,67.94 arc-67 19.82,69.85 arc-67 21.09,71.75 arc67 v22.36,73.66
  Bottom 0.406: v31.25,88.9 31.25,87 arc90 v33.16,85.09 | v22.36,77.47 v22.36,73.66 | v22.36,66.04 arc67 v21.09,67.94
V_BIAS
  Top 0.406: R22.2 C1.+ arc90 26.8,97.41 26.8,90.81 | R18.2 R17.1 R19.2 arc90 26.8,90.81 | Q3.2 57.41,91.95 arc90 54.11,95.25 48.4,95.25 arc90 46.49,93.34 arc-90 44.59,91.44 38.87,91.44 arc90 36.97,89.53 36.97,88.9 arc-90 35.7,87.63 29.98,87.63 arc-90 26.8,90.81